# Altium schematic sheet [5] POWER.SchDoc: Power
size A4; CompanyName: RADWAG Wagi Elektroniczne; Organization: RADWAG Wagi Elektroniczne; Address1: ul. Bracka 28; Address2: 26-600 RADOM; Address3: POLAND; SheetNumber: 5; SheetTotal: 6
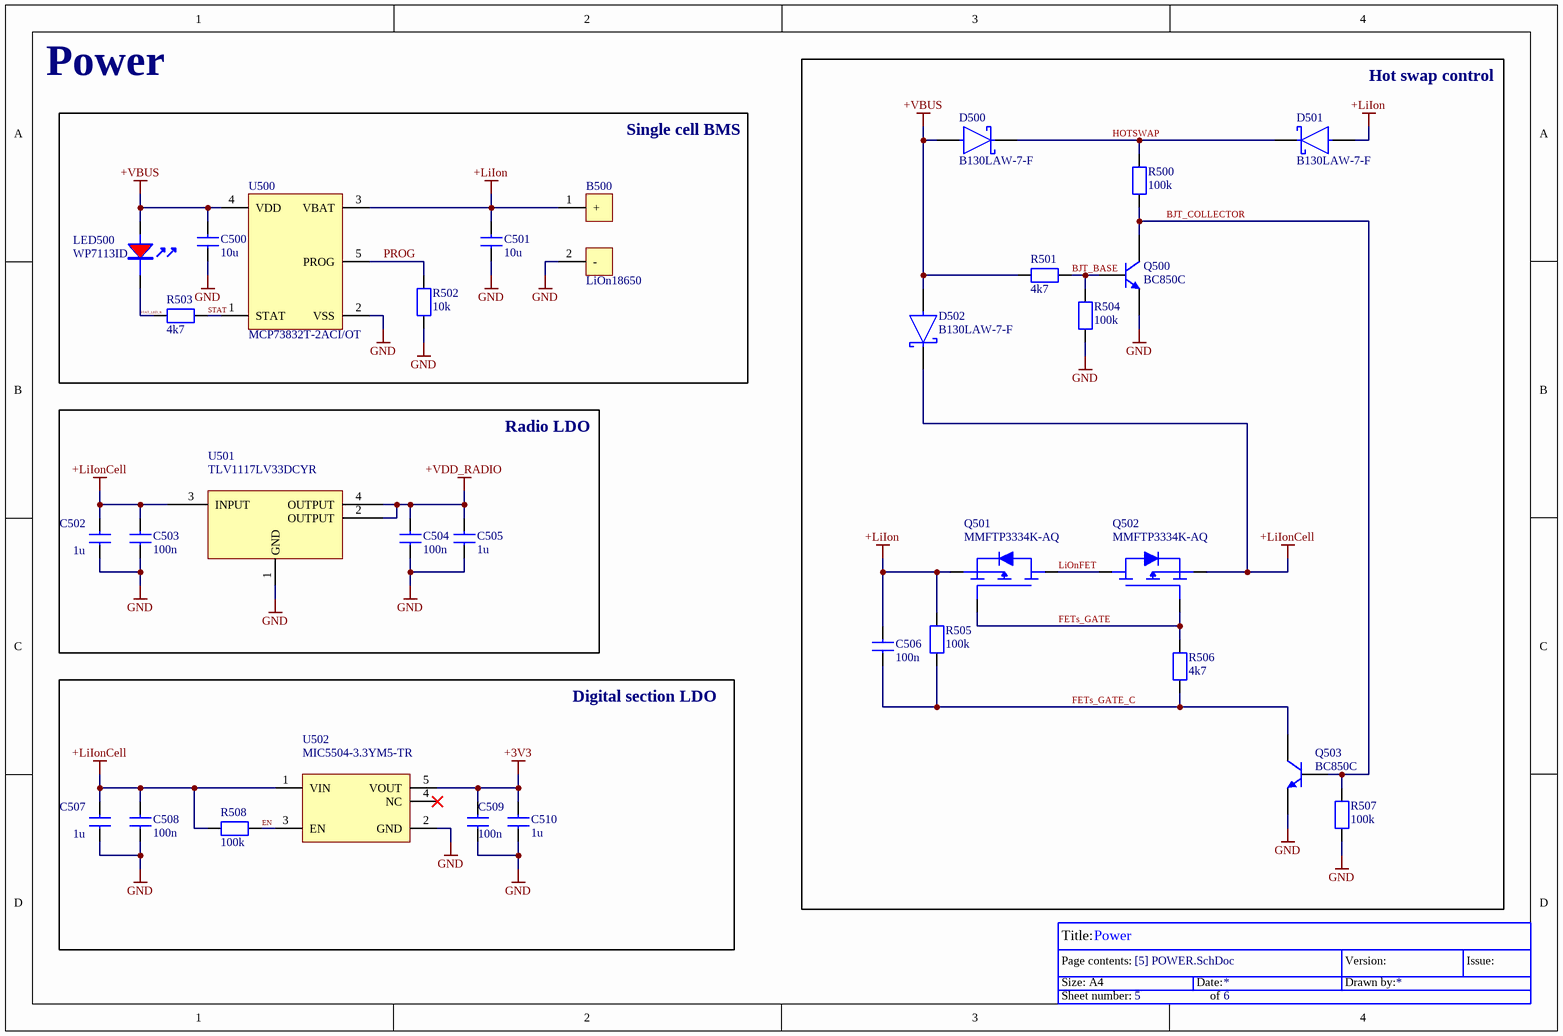
[diagram p0: [5] POWER.SchDoc]

## Parts
B500  LiOn18650  [LION18650]  (no BOM)
C500  10u  [C0402]
C501  10u  [C0402]
C502  1u  [C0402]
C503  100n  [C0402]
C504  100n  [C0402]
C505  1u  [C0402]
C506  100n  [C0402]
C507  1u  [C0402]
C508  100n  [C0402]
C509  100n  [C0402]
C510  1u  [C0402]
D500  B130LAW-7-F  [SOD-123]
D501  B130LAW-7-F  [SOD-123]
D502  B130LAW-7-F  [SOD-123]
LED500  WP7113ID  [LED5mm]
Q500  BC850C  [SOT23]
Q501  MMFTP3334K-AQ  [SOT23]
Q502  MMFTP3334K-AQ  [SOT23]
Q503  BC850C  [SOT23]
R500  100k  [R0603]
R501  4k7  [R0603]
R502  10k  [R0603]
R503  4k7  [R0603]
R504  100k  [R0603]
R505  100k  [R0603]
R506  4k7  [R0603]
R507  100k  [R0603]
R508  100k  [R0603]
U500  MCP73832T-2ACI/OT  [SOT23-5]
U501  TLV1117LV33DCYR  [SOT223-4]
U502  MIC5504-3.3YM5-TR  [SOT23-5]

## Blocks framed on the sheet
Hot swap control: C506 D500-D502 Q500-Q503 R500 R501 R504-R507
Single cell BMS: B500 C500 C501 LED500 R502 R503 U500
Radio LDO: C502-C505 U501
Digital section LDO: C507-C510 R508 U502

## Nets
+3V3: C509.2 C510.2 U502.5(VOUT)
+LiIon: B500.1(+) C501.2 C506.2 D501.2(A) Q501.2(S) R505.2 U500.3(VBAT)
+LiIonCell: C502.2 C503.2 C507.2 C508.2 D502.1(C) Q502.2(S) R508.2 U501.3(INPUT) U502.1(VIN)
+VBUS: C500.2 D500.2(A) D502.2(A) LED500.A R501.2 U500.4(VDD)
+VDD_RADIO: C504.2 C505.2 U501.2(OUTPUT) U501.4(OUTPUT)
GND: B500.2(-) C500.1 C501.1 C502.1 C503.1 C504.1 C505.1 C507.1 C508.1 C509.1 C510.1 Q500.2(E) Q503.2(E) R502.1 R504.1 R507.1 U500.2(VSS) U501.1(GND) U502.2(GND)
BJT_BASE: Q500.1(B) R501.1 R504.2
BJT_COLLECTOR: Q500.3(C) Q503.1(B) R500.1 R507.2
EN: R508.1 U502.3(EN)
FETs_GATE: Q501.1(G) Q502.1(G) R506.1
FETs_GATE_C: C506.1 Q503.3(C) R505.1 R506.2
HOTSWAP: D500.1(C) D501.1(C) R500.2
LiOnFET: Q501.3(D) Q502.3(D)
PROG: R502.2 U500.5(PROG)
STAT: R503.1 U500.1(STAT)
STAT_LED_K: LED500.K R503.2

Not connected (* = marked no-connect by the designer): U502 4(NC)*

## Notes on the sheet
- Title:
- Size: A4
- Page contents:
- Date:
- Version:
- Drawn by:
- Issue:
- Sheet number:
- of

## Library data of the parts
B500 = LiOn18650: LiOn18650 - single cell battery, soldered to PCB
C500 C501 = GRJ155R60J106ME11D: Capacitor Ceramic Mlcc 0402 10UF 6.3V SMD; Manufacturer: Murata; Tolerance: 20%; Supplier: Arrow Electronics; Supplier Part Number: GRJ155R60J106ME11D; Manufacturer Part Number: GRJ155R60J106ME11D; RoHS: Yes; Category: Ceramic Capacitors; Stock: 10000; Pricing: 10000=0,0311, 20000=0,0295, 30000=0,0278, 50000=0,0262, 100000=0,0221, 250000=0,0204 (USD); Mounting Technology: Surface Mount; Case/Package: 0402; Case Code (Metric): 1005; Case Code (Imperial): 0402; Min Operating Temperature: -55°C; Max Operating Temperature: 85°C; Packaging: Cut Tape; Value: 10uF; Voltage Rating: 6.3V; Features: Soft Termination; Series: GRJ; Length: 0.039inch; Width: 0.02inch; Thickness: 0.028inch; RoHS Compliant: Yes; ComponentLink1URL: https://datasheet.octopart.com/GRJ155R60J106ME11D-Murata-datasheet-149522788.pdf?src-supplier=Newark; ComponentLink1Description: https://datasheet.octopart.com/GRJ155R60J106ME11D-Murata-datasheet-149522788.pdf?src-supplier=Newark; ComponentLink2URL: http://psearch.en.murata.com/capacitor/product/GRJ155R60J106ME11%23.pdf?src-supplier=Digi-Key; ComponentLink2Description: http://psearch.en.murata.com/capacitor/product/GRJ155R60J106ME11%23.pdf?src-supplier=Digi-Key; ComponentLink3URL: https://datasheet.octopart.com/GRJ155R60J106ME11D-Murata-datasheet-165579666.pdf?src-supplier=TME; ComponentLink3Description: https://datasheet.octopart.com/GRJ155R60J106ME11D-Murata-datasheet-165579666.pdf?src-supplier=TME
C502 C505 C507 C510 = 0402X105K100CT: Multilayer Ceramic Capacitor, 1 uF, 10%, X5r, 10 V, 0402 [1005 Metric]; Manufacturer: Walsin Technologies; Supplier: Arrow Electronics; Supplier Part Number: 0402X105K100CT; Manufacturer Part Number: 0402X105K100CT; RoHS: Yes; Category: Ceramic Capacitors; Stock: 760000; Pricing: 10000=0,0037, 20000=0,0027, 50000=0,0026, 100000=0,0025, 250000=0,0023 (USD); ComponentLink1URL: http://www.farnell.com/datasheets/2340522.pdf?src-supplier=Farnell; ComponentLink1Description: http://www.farnell.com/datasheets/2340522.pdf?src-supplier=Farnell; ComponentLink2URL: http://www.farnell.com/datasheets/1958513.pdf?src-supplier=Farnell; ComponentLink2Description: http://www.farnell.com/datasheets/1958513.pdf?src-supplier=Farnell; ComponentLink3URL: http://www.farnell.com/datasheets/1958513.pdf?src-supplier=Element14; ComponentLink3Description: http://www.farnell.com/datasheets/1958513.pdf?src-supplier=Element14; ComponentLink4URL: https://datasheet.octopart.com/0402X105K100CT-Walsin-Technologies-datasheet-128065749.pdf?src-supplier=Future+Electronics; ComponentLink4Description: https://datasheet.octopart.com/0402X105K100CT-Walsin-Technologies-datasheet-128065749.pdf?src-supplier=Future+Electronics; ComponentLink5URL: https://datasheet.octopart.com/0402X105K100CT-Walsin-Technologies-datasheet-62066062.pdf?src-supplier=TME; ComponentLink5Description: https://datasheet.octopart.com/0402X105K100CT-Walsin-Technologies-datasheet-62066062.pdf?src-supplier=TME; ComponentLink6URL: https://datasheet.octopart.com/0402X105K100CT-Walsin-Technologies-datasheet-136037192.pdf?src-supplier=TECHDesign; ComponentLink6Description: https://datasheet.octopart.com/0402X105K100CT-Walsin-Technologies-datasheet-136037192.pdf?src-supplier=TECHDesign
C503 C504 C506 C508 C509 = 04023C104KAT2A: Multilayer Ceramic Capacitor, 0.1 uF, 25 V, ± 10%, X7R, 0402 [1005 Metric]; Manufacturer: Kyocera AVX; Material: 4241ConductorMaterial; Value: 100nF; Voltage Rating: 25V; Supplier: Arrow Electronics; Supplier Part Number: 04023C104KAT2A; Manufacturer Part Number: 04023C104KAT2A; RoHS: Yes; Category: Ceramic Capacitors; Stock: 5700000; Pricing: 10000=0,0064, 20000=0,0061, 30000=0,0058, 50000=0,0052, 100000=0,0042, 150000=0,0038 (USD); Mounting Technology: Surface Mount; Case/Package: 0402; Pins: 2; Case Code (Metric): 1005; Case Code (Imperial): 0402; Min Operating Temperature: -55°C; Max Operating Temperature: 125°C; Tolerance: 10%; Dielectric: X7R; Packaging: Cut Tape; Voltage Rating (DC): 25V; Voltage: 25V; Series: -; Width: 1mm; Reach SVHC Compliant: No; Lead Free: Lead Free; RoHS Compliant: Yes; ComponentLink1URL: https://datasheet.ciiva.com/6265/cx7r-6265272.pdf?src-supplier=Digi-Key; ComponentLink1Description: https://datasheet.ciiva.com/6265/cx7r-6265272.pdf?src-supplier=Digi-Key; ComponentLink2URL: https://datasheet.ciiva.com/1123/1679506-1123344.pdf?src-supplier=Element14; ComponentLink2Description: https://datasheet.ciiva.com/1123/1679506-1123344.pdf?src-supplier=Element14; ComponentLink3URL: https://datasheet.ciiva.com/7709/1679506-7709527.pdf?src-supplier=Element14; ComponentLink3Description: https://datasheet.ciiva.com/7709/1679506-7709527.pdf?src-supplier=Element14; ComponentLink4URL: https://datasheet.ciiva.com/14906/cx7r-14906223.pdf?src-supplier=Digi-Key; ComponentLink4Description: https://datasheet.ciiva.com/14906/cx7r-14906223.pdf?src-supplier=Digi-Key; ComponentLink5URL: https://datasheet.ciiva.com/7614/cx7r-7614663.pdf?src-supplier=Digi-Key; ComponentLink5Description: https://datasheet.ciiva.com/7614/cx7r-7614663.pdf?src-supplier=Digi-Key
D500-D502 = B130LAW-7-F: Rectifier Diode Schottky 30V 1A 2-Pin SOD-123 T/R / DIODE SCHOTTKY 30V 1A SOD123; Manufacturer: Diodes; Max Reverse Current: 1mA; Peak Non-Repetitive Surge Current: 12A; Forward Voltage: 420mV; Polarity: Standard; Value: 40pF; Supplier: Arrow Electronics; Supplier Part Number: B130LAW-7-F; Manufacturer Part Number: B130LAW-7-F; RoHS: Yes; Category: Rectifier Diodes; Stock: 93000; Pricing: 3000=0,0709 (USD); Mounting Technology: Surface Mount; Pins: 2; Weight: 0.000353oz; Contact Plating: Tin,Matte; Min Operating Temperature: -55°C; Max Operating Temperature: 125°C; Forward Current: 1A; Max Repetitive Reverse Voltage (Vrrm): 30V; Package Quantity: 3000; Packaging: Tape and Reel; Average Rectified Current: 1A; Max Forward Surge Current (Ifsm): 12A; Termination: SMD/SMT; Voltage Rating (DC): 30V; Current Rating: 1A; Output Current: 1A; Max Reverse Voltage (DC): 30V; Series: -; Reverse Voltage: 30V; Length: 2.85mm; Width: 1.7mm; Height: 1.25mm; Radiation Hardening: No; Reach SVHC Compliant: No; Lead Free: Lead Free; RoHS Compliant: Yes; ComponentLink1URL: https://datasheet.ciiva.com/913/ds30308-913553.pdf?src-supplier=Digi-Key; ComponentLink1Description: https://datasheet.ciiva.com/913/ds30308-913553.pdf?src-supplier=Digi-Key; ComponentLink2URL: https://datasheet.ciiva.com/34302/1538689-34302354.pdf?src-supplier=Jameco; ComponentLink2Description: https://datasheet.ciiva.com/34302/1538689-34302354.pdf?src-supplier=Jameco; ComponentLink3URL: https://datasheet.ciiva.com/4715/ds30308-79347-4715540.pdf?src-supplier=Mouser; ComponentLink3Description: https://datasheet.ciiva.com/4715/ds30308-79347-4715540.pdf?src-supplier=Mouser; ComponentLink4URL: https://datasheet.ciiva.com/1177/ds30308-1177411.pdf?src-supplier=Element14; ComponentLink4Description: https://datasheet.ciiva.com/1177/ds30308-1177411.pdf?src-supplier=Element14; ComponentLink5URL: https://datasheet.ciiva.com/22695/887879-22695783.pdf?src-supplier=Element14; ComponentLink5Description: https://datasheet.ciiva.com/22695/887879-22695783.pdf?src-supplier=Element14; ComponentLink6URL: https://datasheet.ciiva.com/8300/ds30308-8300503.pdf?src-supplier=Avnet; ComponentLink6Description: https://datasheet.ciiva.com/8300/ds30308-8300503.pdf?src-supplier=Avnet; ComponentLink7URL: https://datasheet.ciiva.com/8303/ds30308-8303245.pdf?src-supplier=Avnet; ComponentLink7Description: https://datasheet.ciiva.com/8303/ds30308-8303245.pdf?src-supplier=Avnet; ComponentLink8URL: https://datasheet.ciiva.com/913/ds30308-913554.pdf?src-supplier=Digi-Key; ComponentLink8Description: https://datasheet.ciiva.com/913/ds30308-913554.pdf?src-supplier=Digi-Key; ComponentLink9URL: https://datasheet.ciiva.com/913/ds30308-913555.pdf?src-supplier=Digi-Key; ComponentLink9Description: https://datasheet.ciiva.com/913/ds30308-913555.pdf?src-supplier=Digi-Key
LED500 = WP7113ID: Red T-1 3/4 5 mm 30° 50 mcd 2.2 V Tinted Solid State LED Lamp Through Hole; Manufacturer: Kingbright; Supplier: Mouser; Supplier Part Number: 604-WP7113ID; Manufacturer Part Number: WP7113ID; RoHS: Yes; Category: LEDs; Stock: 35900; Pricing: 1=0,1, 10=0,072, 50=0,072, 100=0,072, 1000=0,068, 10000=0,06 (USD); ComponentLink1URL: https://datasheet.ciiva.com/2114/wp7113id-2114384.pdf?src-supplier=Digi-Key; ComponentLink1Description: https://datasheet.ciiva.com/2114/wp7113id-2114384.pdf?src-supplier=Digi-Key; ComponentLink2URL: https://datasheet.ciiva.com/4692/wp7113id-48891-4692862.pdf?src-supplier=Mouser; ComponentLink2Description: https://datasheet.ciiva.com/4692/wp7113id-48891-4692862.pdf?src-supplier=Mouser; ComponentLink3URL: https://datasheet.ciiva.com/16210/wp7113id-16210118.pdf?src-supplier=Future+Electronics; ComponentLink3Description: https://datasheet.ciiva.com/16210/wp7113id-16210118.pdf?src-supplier=Future+Electronics
Q500 Q503 = BC850C: Trans GP BJT NPN 45V 0.1A 250mW Automotive 3-Pin SOT-23 T/R; Manufacturer: Diotec; Supplier: Mouser; Supplier Part Number: 637-BC850C; Manufacturer Part Number: BC850C; RoHS: Yes; Category: BJTs; Stock: 12088; Pricing: 1=0,18, 10=0,105, 50=0,105, 100=0,076, 1000=0,053, 10000=0,025 (USD); ComponentLink1URL: http://datasheet.octopart.com/BC850C-Diotec-datasheet-17564964.pdf?src-supplier=Verical; ComponentLink1Description: http://datasheet.octopart.com/BC850C-Diotec-datasheet-17564964.pdf?src-supplier=Verical; ComponentLink2URL: http://datasheet.octopart.com/BC850C-Diotec-datasheet-17564964.pdf?src-supplier=Mouser; ComponentLink2Description: http://datasheet.octopart.com/BC850C-Diotec-datasheet-17564964.pdf?src-supplier=Mouser; ComponentLink3URL: http://datasheet.octopart.com/BC850C-Diotec-datasheet-17564964.pdf?src-supplier=Distrelec; ComponentLink3Description: http://datasheet.octopart.com/BC850C-Diotec-datasheet-17564964.pdf?src-supplier=Distrelec; ComponentLink4URL: http://datasheet.octopart.com/BC850C-Diotec-datasheet-17564964.pdf?src-supplier=Onlinecomponents.com; ComponentLink4Description: http://datasheet.octopart.com/BC850C-Diotec-datasheet-17564964.pdf?src-supplier=Onlinecomponents.com; ComponentLink5URL: https://datasheet.octopart.com/BC850C-Diotec-datasheet-149503847.pdf?src-supplier=TME; ComponentLink5Description: https://datasheet.octopart.com/BC850C-Diotec-datasheet-149503847.pdf?src-supplier=TME; ComponentLink6URL: http://datasheet.octopart.com/BC850C-Diotec-datasheet-17564964.pdf?src-supplier=DComponents; ComponentLink6Description: http://datasheet.octopart.com/BC850C-Diotec-datasheet-17564964.pdf?src-supplier=DComponents; ComponentLink7URL: http://datasheet.octopart.com/BC850C-Diotec-datasheet-17564964.pdf?src-supplier=Electro+Sonic; ComponentLink7Description: http://datasheet.octopart.com/BC850C-Diotec-datasheet-17564964.pdf?src-supplier=Electro+Sonic
Q501 Q502 = MMFTP3334K-AQ: Mosfet, SOT-23, 30V, 4A, P, 1W; Manufacturer: Diotec; Supplier: Mouser; Supplier Part Number: 637-MMFTP3334K-AQ; Manufacturer Part Number: MMFTP3334K-AQ; RoHS: No; Category: Uncategorized; Pricing: 1=0,6, 10=0,51, 50=0,51, 100=0,401, 1000=0,32, 10000=0,126 (USD)
R500 R504 R505 R507 R508 = CRCW0603100KFKEBC: CRCW Thick Film Commodity Chip Resistor 0603 Size 100K Ohm 1% 0.1 W 100 ppm/K 2-Pin SMD Paper T/R; Manufacturer: Vishay; Value: 100kR; Max Power Dissipation: 100mW; Temperature Coefficient: 100ppm/°C; Supplier: Mouser; Supplier Part Number: 71-CRCW0603100KFKEBC; Manufacturer Part Number: CRCW0603100KFKEBC; RoHS: Yes; Category: Chip SMD Resistors; Stock: 86866; Pricing: 1=0,1, 10=0,018, 50=0,018, 100=0,008, 1000=0,006, 10000=0,003 (USD); Case/Package: 0603; Min Operating Temperature: -55°C; Max Operating Temperature: 155°C; Packaging: Tape and Reel; Tolerance: 1%; Number of Terminations: 2; Series: CRCW-C; RoHS Compliant: Yes; Lead Free: 5697LeadFree; ComponentLink1URL: http://www.vishay.com/docs/28773/crcwce3.pdf?src-supplier=Digi-Key; ComponentLink1Description: http://www.vishay.com/docs/28773/crcwce3.pdf?src-supplier=Digi-Key
R501 R503 R506 = AF0603FR-074K7L: Res Thick Film 0603 4.7K Ohm 1% 1/10W ±100ppm/°C Molded SMD Paper T/R; Manufacturer: Yageo; Supplier: Arrow Electronics; Supplier Part Number: AF0603FR-074K7L; Manufacturer Part Number: AF0603FR-074K7L; RoHS: Yes; Category: Chip SMD Resistors; Stock: 178; Pricing: 1=0,0339, 10=0,0163, 25=0,0156, 100=0,0114 (USD); ComponentLink1URL: http://www.mouser.com/ds/2/447/PYu-AF_51_RoHS_L_5-1085711.pdf?src-supplier=Mouser; ComponentLink1Description: http://www.mouser.com/ds/2/447/PYu-AF_51_RoHS_L_5-1085711.pdf?src-supplier=Mouser; ComponentLink2URL: https://datasheet.octopart.com/AF0603FR-074K7L-Yageo-datasheet-164730775.pdf?src-supplier=Future+Electronics; ComponentLink2Description: https://datasheet.octopart.com/AF0603FR-074K7L-Yageo-datasheet-164730775.pdf?src-supplier=Future+Electronics; ComponentLink3URL: http://www.yageo.com/documents/recent/PYu-AF_51_RoHS_L_5.pdf?src-supplier=Digi-Key; ComponentLink3Description: http://www.yageo.com/documents/recent/PYu-AF_51_RoHS_L_5.pdf?src-supplier=Digi-Key
R502 = AC0603JR-0710KL: SMD Chip Resistor, 10 kOhm, ± 5%, 100 mW, 0603 [1608 Metric], Thick Film, General Purpose; Manufacturer: Yageo; Voltage Rating: 50V; Value: 10kR; Power Rating: 100mW; Temperature Coefficient: 100ppm/°C; Supplier: Arrow Electronics; Supplier Part Number: AC0603JR-0710KL; Manufacturer Part Number: AC0603JR-0710KL; RoHS: Yes; Category: Chip SMD Resistors; Stock: 801; Pricing: 1=0,0527, 10=0,012, 25=0,0107, 100=0,007, 250=0,0069, 500=0,0062 (USD); Case/Package: 0603; Case Code (Imperial): 0603; Case Code (Metric): 1608; Min Operating Temperature: -55°C; Max Operating Temperature: 155°C; Packaging: Tape and Reel; Tolerance: 5%; Termination: SMD/SMT; Number of Terminations: 2; Max Power Dissipation: 100mW; Features: Moisture Resistant,Automotive AEC-Q200; Series: AC; Ratings: AEC-Q200; Lead Free: Lead Free; RoHS Compliant: Yes; ComponentLink1URL: https://datasheet.ciiva.com/5562/pyu-ac-51-rohs-l-2-5562553.pdf?src-supplier=Mouser; ComponentLink1Description: https://datasheet.ciiva.com/5562/pyu-ac-51-rohs-l-2-5562553.pdf?src-supplier=Mouser
U500 = MCP73832T-2ACI/OT: MCP73832 Series Single-Cell Li-Ion/Li-Polymer Battery Charge Controller SOT-23-5; Manufacturer: Microchip; Supplier: Arrow Electronics; Supplier Part Number: MCP73832T-2ACI/OT; Manufacturer Part Number: MCP73832T-2ACI/OT; RoHS: Yes; Category: Battery Management; Stock: 8708; Pricing: 1=0,7211, 10=0,7209, 25=0,7119, 100=0,7029, 250=0,6938, 500=0,6848, 1000=0,6758, 3000=0,6668, 6000=0,6578 (USD); ComponentLink1URL: https://datasheet.ciiva.com/1931/21984e-1931959.pdf?src-supplier=Digi-Key; ComponentLink1Description: https://datasheet.ciiva.com/1931/21984e-1931959.pdf?src-supplier=Digi-Key; ComponentLink2URL: https://datasheet.ciiva.com/1931/21984e-1931960.pdf?src-supplier=Digi-Key; ComponentLink2Description: https://datasheet.ciiva.com/1931/21984e-1931960.pdf?src-supplier=Digi-Key; ComponentLink3URL: https://datasheet.ciiva.com/1931/21984e-1931961.pdf?src-supplier=Digi-Key; ComponentLink3Description: https://datasheet.ciiva.com/1931/21984e-1931961.pdf?src-supplier=Digi-Key
U501 = TLV1117LV33DCYR: IC REG LDO 3.3V 1A SOT223; Manufacturer: Texas Instruments; Supplier: Mouser; Supplier Part Number: 595-TLV1117LV33DCYR; Manufacturer Part Number: TLV1117LV33DCYR; RoHS: Yes; Category: Voltage Regulators - Linear; Stock: 41813; Pricing: 1=0,35, 10=0,261, 50=0,261, 100=0,146, 1000=0,108, 10000=0,087 (USD); ComponentLink1URL: https://datasheet.ciiva.com/2060/tlv1117lv-2060226.pdf?src-supplier=Digi-Key; ComponentLink1Description: https://datasheet.ciiva.com/2060/tlv1117lv-2060226.pdf?src-supplier=Digi-Key; ComponentLink2URL: https://datasheet.ciiva.com/2060/tlv1117lv-2060227.pdf?src-supplier=Digi-Key; ComponentLink2Description: https://datasheet.ciiva.com/2060/tlv1117lv-2060227.pdf?src-supplier=Digi-Key; ComponentLink3URL: https://datasheet.ciiva.com/2060/tlv1117lv-2060228.pdf?src-supplier=Digi-Key; ComponentLink3Description: https://datasheet.ciiva.com/2060/tlv1117lv-2060228.pdf?src-supplier=Digi-Key; ComponentLink4URL: https://datasheet.ciiva.com/46443/1857581-46443437.pdf?src-supplier=Element14; ComponentLink4Description: https://datasheet.ciiva.com/46443/1857581-46443437.pdf?src-supplier=Element14; ComponentLink5URL: https://datasheet.ciiva.com/46443/1857581-46443438.pdf?src-supplier=Element14; ComponentLink5Description: https://datasheet.ciiva.com/46443/1857581-46443438.pdf?src-supplier=Element14; ComponentLink6URL: https://datasheet.ciiva.com/46443/1857581-46443450.pdf?src-supplier=Element14; ComponentLink6Description: https://datasheet.ciiva.com/46443/1857581-46443450.pdf?src-supplier=Element14
U502 = MIC5504-3.3YM5-TR: LDO Regulator Pos 3.3V 0.3A Medical 5-Pin SOT-23 T/R / IC REG LDO 3.3V 0.3A SOT-23-5; Manufacturer: Microchip; Supplier: Arrow Electronics; Supplier Part Number: MIC5504-3.3YM5-TR; Manufacturer Part Number: MIC5504-3.3YM5-TR; RoHS: Yes; Category: Voltage Regulators - Linear; Stock: 27000; Pricing: 3000=0,1186 (USD); ComponentLink1URL: https://datasheet.ciiva.com/46425/1856860-46425639.pdf?src-supplier=Element14; ComponentLink1Description: https://datasheet.ciiva.com/46425/1856860-46425639.pdf?src-supplier=Element14